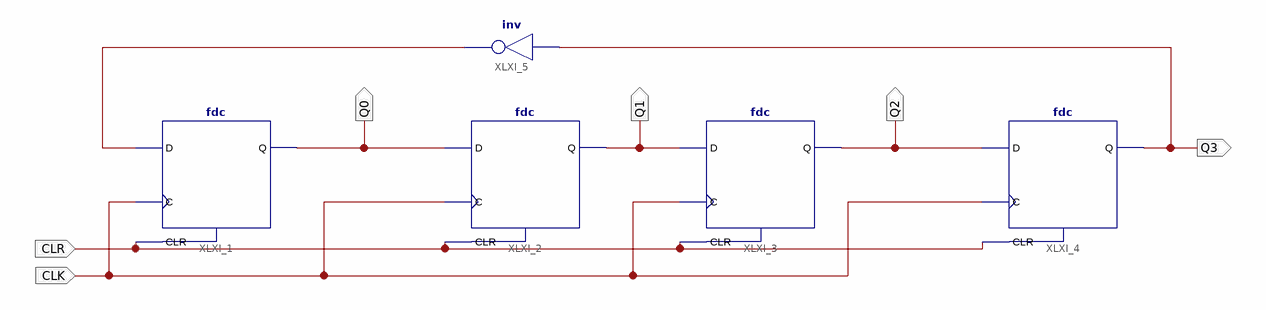
[diagram p0: schematic sheet 1]
// Xilinx ISE schematic p3ej1a.sch (spartan3) as structural Verilog: 5 symbols, 6 ports
module p3ej1a (
  input  CLR,
  input  CLK,
  output Q0,
  output Q1,
  output Q2,
  output Q3
);

  wire XLXN_8;

  fdc XLXI_1 (.C(CLK), .CLR(CLR), .D(XLXN_8), .Q(Q0));
  fdc XLXI_2 (.C(CLK), .CLR(CLR), .D(Q0), .Q(Q1));
  fdc XLXI_3 (.C(CLK), .CLR(CLR), .D(Q1), .Q(Q2));
  fdc XLXI_4 (.C(CLK), .CLR(CLR), .D(Q2), .Q(Q3));
  not XLXI_5 (XLXN_8, Q3);
endmodule
